# EAGLE schematic jinkan_5m (EAGLE 9.2.1)
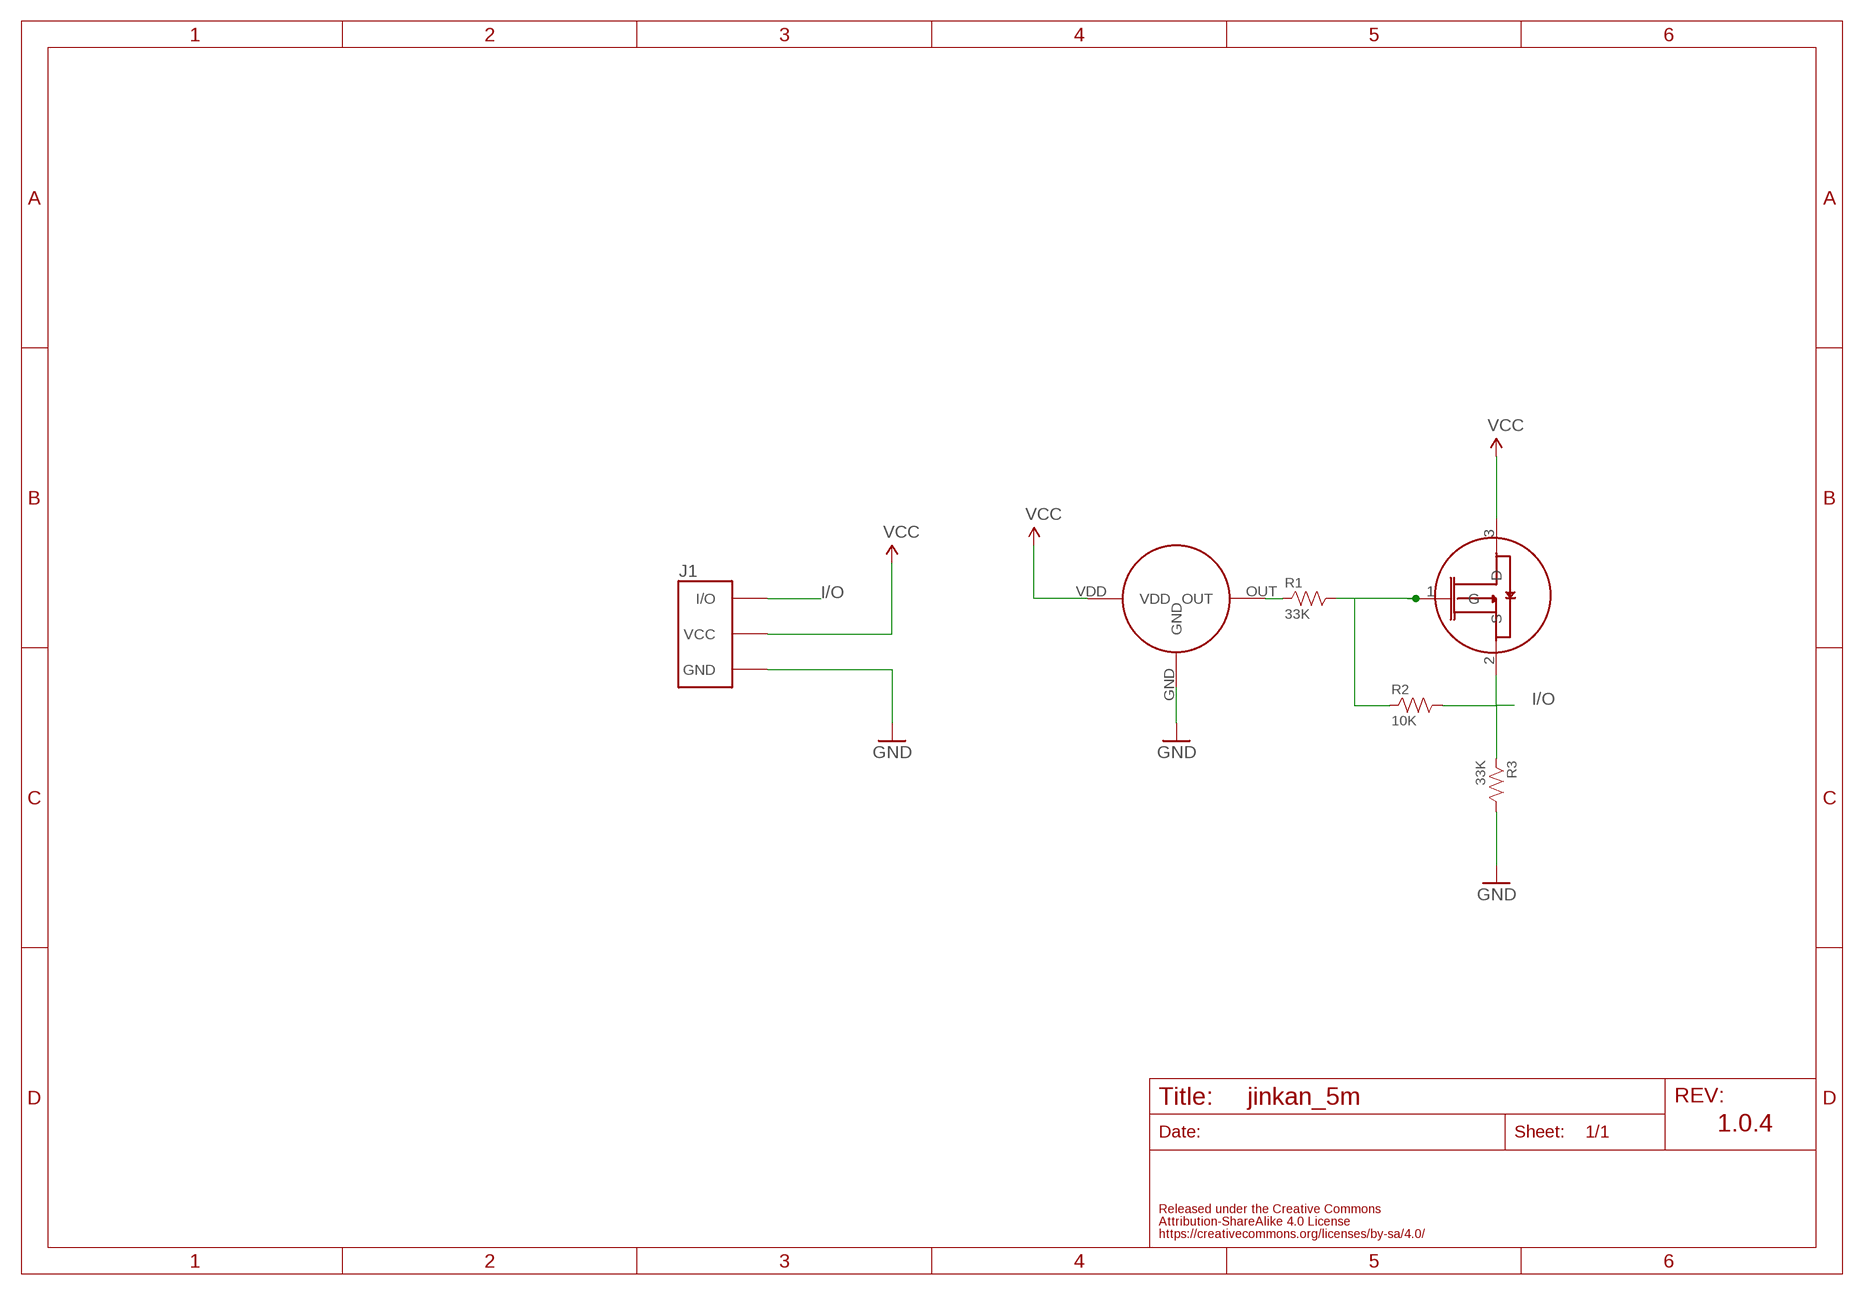
[diagram p0: schematic, sheet 1]

## Parts
J1  FABO_BRICK_3PIN-B03-PASK-1_SILK_BOTTOM  [FABO_BRICK_3PIN_B03B-PASK-1_SILK_BOTTOM]
R1  33K  RESISTOR-0603  [0603]
R2  10K  RESISTOR-0603  [0603]
R3  33K  RESISTOR-0603  [0603]
SW1  FAIRCHILD-FDN338  [SOT23]
U$4  EKBM  [EKMB]

## Nets
GND: J1.GND R3.2 U$4.GND
I/O: J1.I/O R2.2 R3.1 SW1.2(S)
N$1: R1.1 U$4.OUT
N$2: R1.2 R2.1 SW1.1(G)
VCC: J1.VCC SW1.3(D) U$4.VDD

## Notes on the sheet
- 1.0.4

## Library data of the parts
J1 = FaBo-Template:FABO_BRICK_3PIN: FaBo Brick 3pin
R1-R3 = FaBo-Resistors:RESISTOR: RESISTOR
SW1 = FaBo-Parts:FAIRCHILD-FDN338
U$4 = FaBo-Sensor:EKBM